# EasyEDA Pro project ProProject_luckycharm_2024-02-05.epro

# Schematic sch
Create Date: 2024-01-07; Page Name: P1; Project Name: 大富翁 幸运符; Schematic Name: sch; Update Date: 2024-02-02; Company: 嘉立创EDA; Drawed: m0dular; Page Size: A4; Version: V1.0
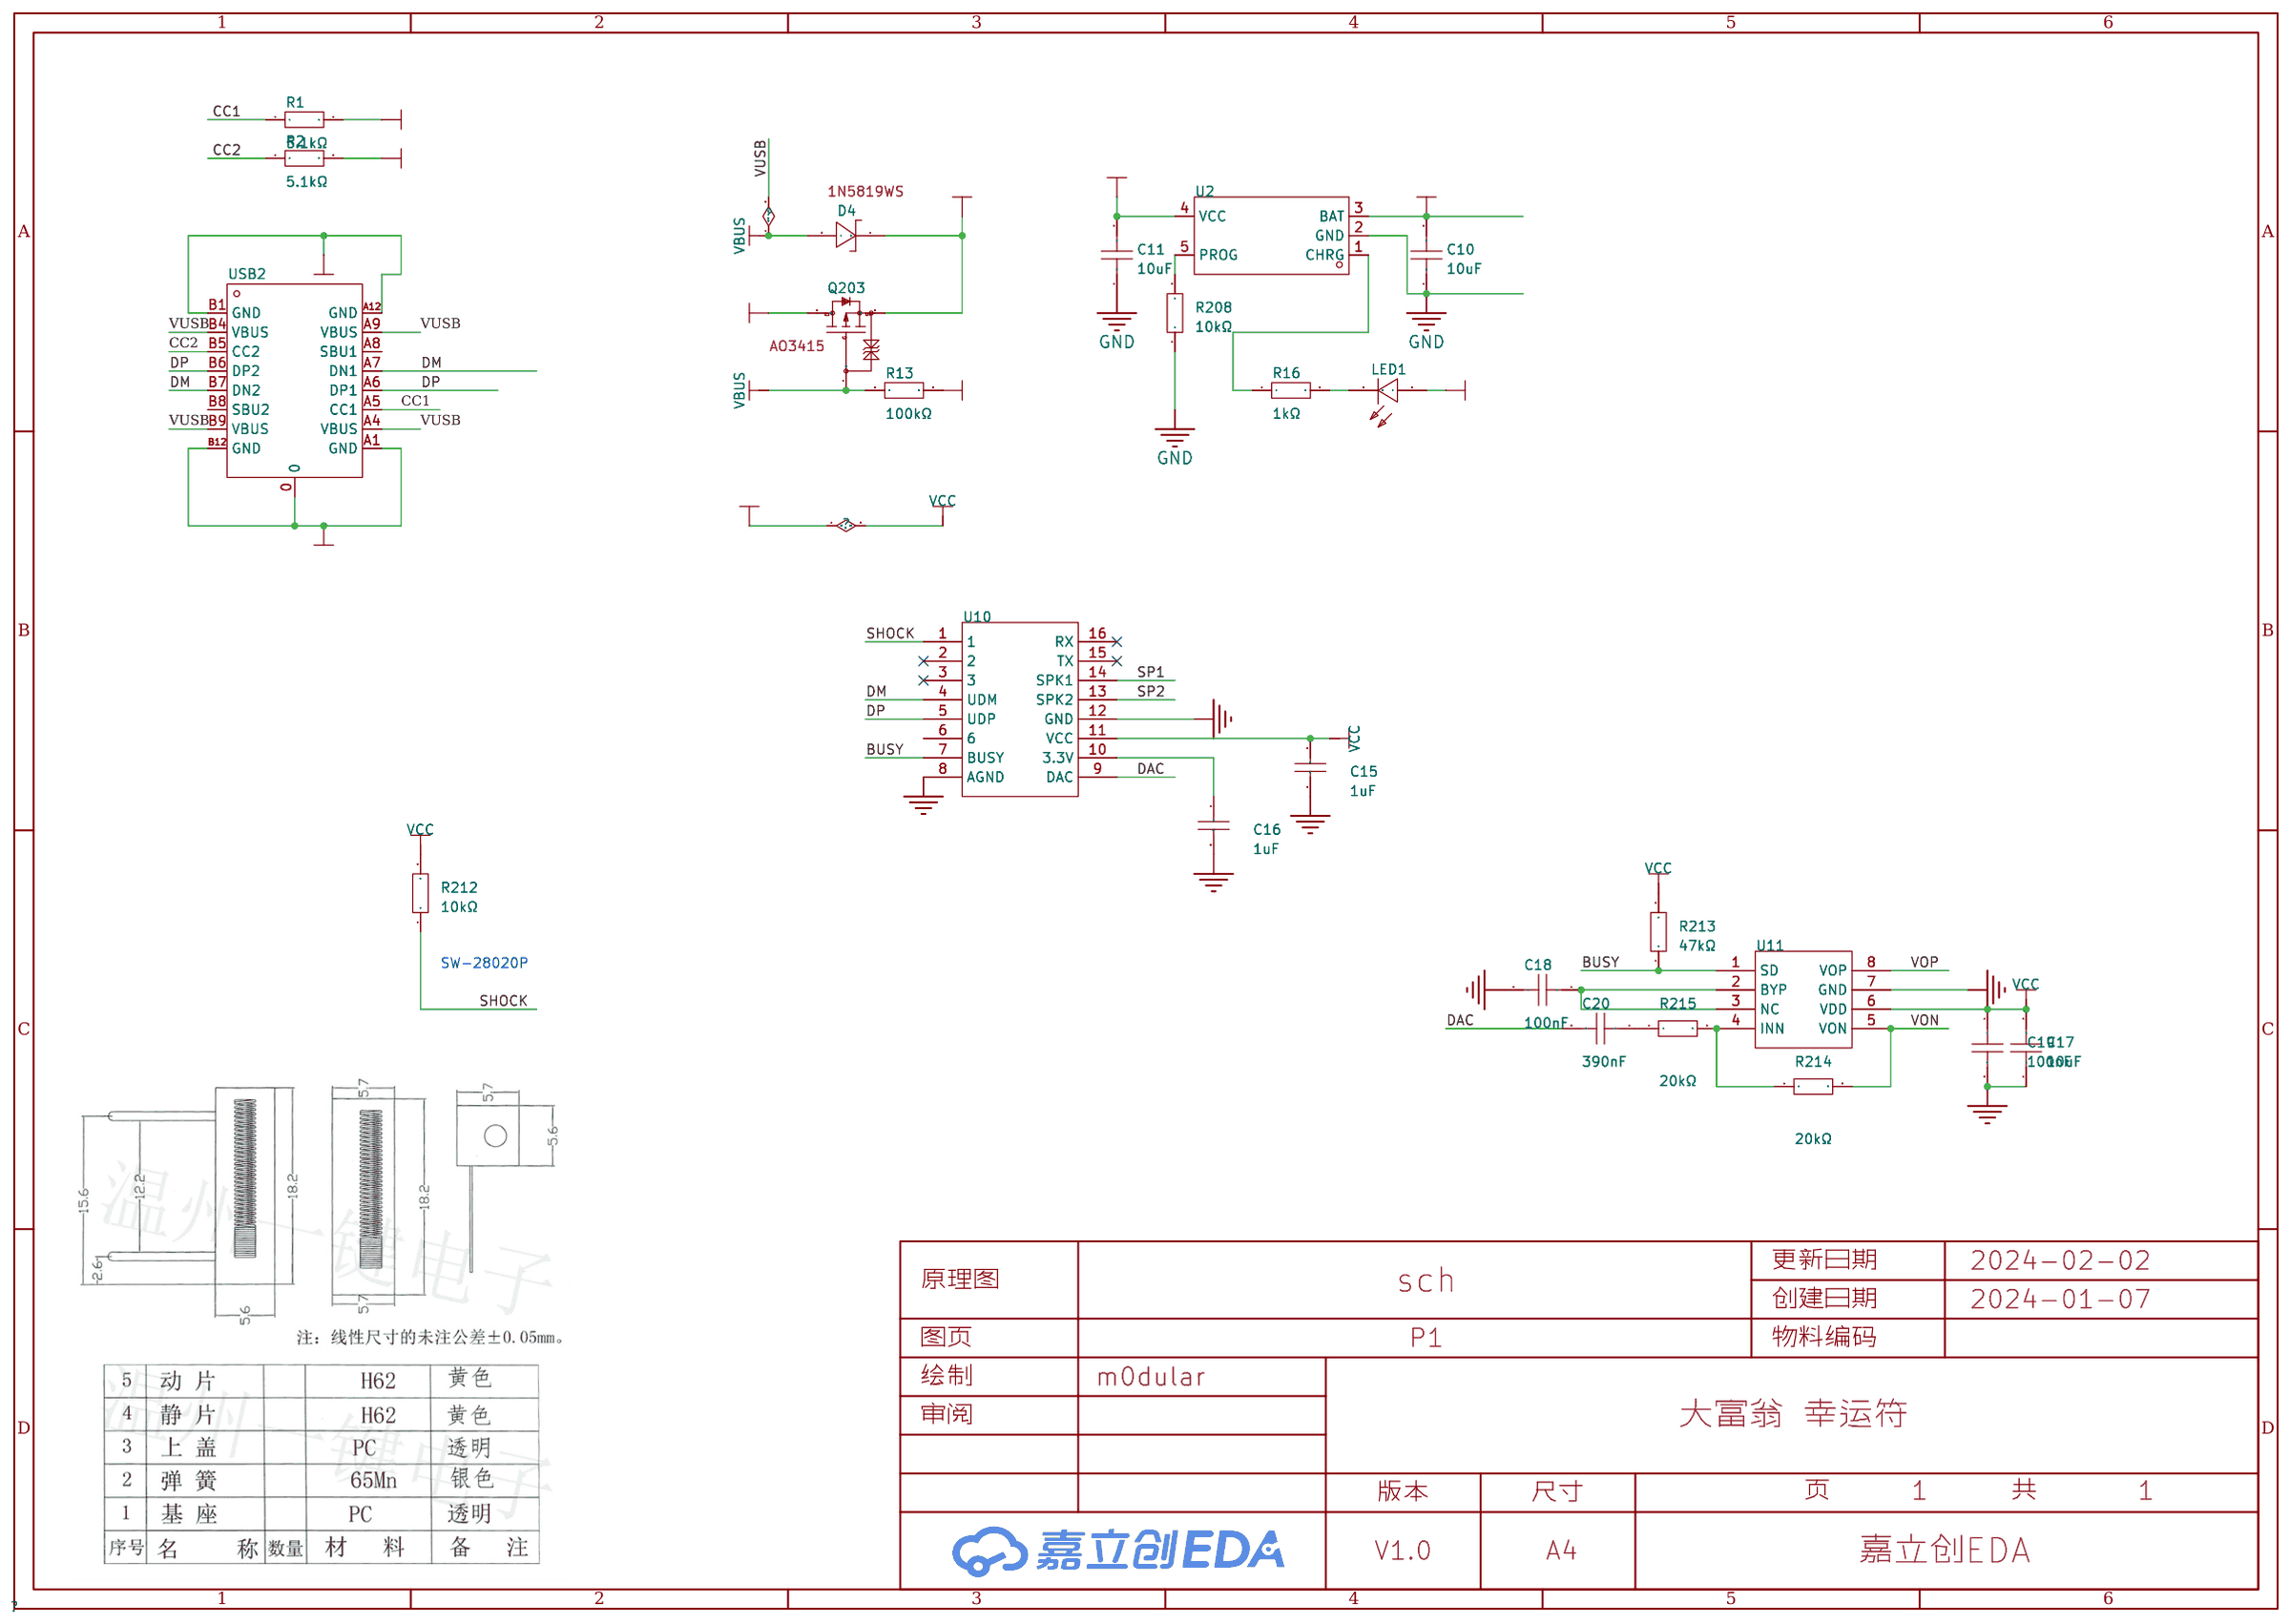
[diagram p0: schematic sheet]

## Parts
C10  10uF  [c0603]
C11  10uF  [c0603]
C15  1uF  [C0603]
C16  1uF  [C0603]
C17  10uF  [c0603]  (no BOM)
C18  100nF  [C0603]  (no BOM)
C19  100nF  [C0603]  (no BOM)
C20  390nF  [C0603]  (no BOM)
D4  -  [sod-323_l1.8-w1.3-ls2.5-rd]
LED1  -  [led0603-r-rd]
Q203  -  [sot-23-3_l2.9-w1.3-p1.90-ls2.4-br]
R1  5.1kΩ  [R0603]
R2  5.1kΩ  [R0603]
R13  100kΩ  [R0603]
R16  1kΩ  [R0603]
R208  10kΩ  [R0603]
R212  10kΩ  [R0603]
R213  47kΩ  [R0603]  (no BOM)
R214  20kΩ  [R0603]  (no BOM)
R215  20kΩ  [R0603]  (no BOM)
U2  -  [sot-23-5_l3.0-w1.7-p0.95-ls2.8-br]
U10  -  [SOP-16_L9.9-W3.9-P1.27-LS6.0-BL]
U11  -  [SOP-8_L4.9-W3.9-P1.27-LS6.2-TL]  (no BOM)
USB2  -  [usb-c_smd-type-c-31-m-12]

## Library data of the parts
C10 C11 C17 = CL10A106KP8NNNC: 容值:10uF;精度:±10%;额定电压:10V;温度系数:X5R;; LCSC Part Name: 10uF ±10% 10V; Supplier Part: C19702; Manufacturer: SAMSUNG(三星); Supplier Footprint: 0603; JLCPCB Part Class: Basic Part; Datasheet: https://atta.szlcsc.com/upload/public/pdf/source/20160103/1457707703378.pdf; Supplier: LCSC; Tolerance: ±10%; Voltage Rated: 10V; Temperature Coefficient: X5R
C15 C16 = CL10A105KB8NNNC: 容值:1uF;精度:±10%;额定电压:50V;材质(温度系数):X5R;; LCSC Part Name: 1uF ±10% 50V; Supplier Part: C15849; Manufacturer: SAMSUNG(三星); Supplier Footprint: 0603; JLCPCB Part Class: 基础库; Datasheet: https://atta.szlcsc.com/upload/public/pdf/source/20160218/1457707763339.pdf; Supplier: LCSC; Tolerance: ±10%; Voltage Rated: 50V; Temperature Coefficient: X5R
C18 C19 = CC0603KRX7R9BB104: 容值:100nF;精度:±10%;额定电压:50V;材质(温度系数):X7R;; LCSC Part Name: 100nF ±10% 50V; Supplier Part: C14663; Manufacturer: YAGEO(国巨); Supplier Footprint: 0603; JLCPCB Part Class: 基础库; Datasheet: https://atta.szlcsc.com/upload/public/pdf/source/20180910/C282072_33301C7F631E79921B82A8DAC6BCC5B3.pdf; Supplier: LCSC; Tolerance: ±10%; Voltage Rated: 50V; Temperature Coefficient: X7R
C20 = GCM188R71C394KA55D: 容值:390nF;精度:±10%;额定电压:16V;材质(温度系数):X7R;; LCSC Part Name: 390nF ±10% 16V; Supplier Part: C437460; Manufacturer: muRata(村田); Supplier Footprint: 0603; JLCPCB Part Class: 扩展库; Datasheet: https://atta.szlcsc.com/upload/public/pdf/source/20191226/C475964_3FAF76C90CD8FFB09F50C7480ADA926F.pdf; Supplier: LCSC; Tolerance: ±10%; Voltage Rated: 16V; Temperature Coefficient: X7R
D4 = 1N5819WS: 直流反向耐压(Vr):40V;平均整流电流(Io):1A;正向压降(Vf):600mV@1A;; LCSC Part Name: 40V 1A 600mV@1A; Supplier Part: C191023; Manufacturer: Hottech(合科泰); Supplier Footprint: SOD-323; JLCPCB Part Class: Basic Part; Datasheet: https://atta.szlcsc.com/upload/public/pdf/source/20180614/C191023_3C6A6398B911F3A4C23E7538EE054643.pdf; Supplier: LCSC; Reverse Voltage (Vr): 40V; Average Rectified Current (Io): 1A; Forward Voltage (Vf@If): 600mV@1A
LED1 = 19-217/R6C-AL1M2VY/3T: 发光颜色:红灯;二极管配置:-;透镜颜色:无色透明;主波长:617.5nm;峰值波长:632nm;色温:-;光通量(25时):-;测试电流:5mA;正向电压(VF):2.2V;发光强度:28.5mcd;功率:60mW;发光角度:120°;安装方式:-;工作温度:-40~+85;; LCSC Part Name: 红灯; Supplier Part: C72044; Manufacturer: EVERLIGHT(台湾亿光); Supplier Footprint: 0603; JLCPCB Part Class: Extended Part; Datasheet: https://atta.szlcsc.com/upload/public/pdf/source/20160507/1462613613821.pdf; Supplier: LCSC; Emitted Color: 红灯; Lens Color: 无色透明; Dominant Wavelength: 617.5nm; Peak Wavelength: 632nm; Forward Current: 5mA; Forward Voltage (VF): 2.2V; Luminous Intensity: 28.5mcd; Power Dissipation: 60mW; Viewing Angle: 120°; Operating Temperature: -40~+85
Q203 = AO3415_C181094: 类型:P沟道;漏源电压(Vdss):20V;连续漏极电流(Id):4A;功率(Pd):1.5W;导通电阻(RDS(on)@Vgs,Id):41mΩ@4.5V,4A;阈值电压(Vgs(th)@Id):900mV@250A;; LCSC Part Name: P沟道 20V 4A; Supplier Part: C181094; Manufacturer: Hottech(合科泰); Manufacturer Part: AO3415; Supplier Footprint: SOT-23(SOT-23-3); JLCPCB Part Class: Extended Part; Datasheet: https://atta.szlcsc.com/upload/public/pdf/source/20180131/C181094_15173931965481329223.pdf; Supplier: LCSC; Type: P沟道; Drain Source Voltage (Vdss): 20V; Continuous Drain Current (Id): 4A; Power Dissipation (Pd): 1.5W; Drain Source On Resistance (RDS(on)@Vgs,Id): 41mΩ@4.5V,4A; Gate Threshold Voltage (Vgs(th)@Id): 900mV@250A
R1 R2 = 0603WAF5101T5E: 电阻类型:厚膜电阻;阻值:5.1kΩ;精度:±1%;功率:1/10W;温度系数:±100ppm/;最大工作电压:75V;工作温度范围:-55~+155;; LCSC Part Name: 5.1kΩ ±1%; Supplier Part: C23186; Manufacturer: UNI-ROYAL(厚声); Supplier Footprint: 0603; JLCPCB Part Class: Basic Part; Datasheet: https://atta.szlcsc.com/upload/public/pdf/source/20200306/C422600_1E6D84923E4A46A82E41ADD87F860B5C.pdf; Supplier: LCSC; Type: 厚膜电阻; Tolerance: ±1%; Power(Watts): 1/10W; Temperature Coefficient: ±100ppm/; Overload Voltage (Max): 75V; Operating Temperature Range: -55~+155
R13 = 0603WAF1003T5E: 精度:±1%;阻值:100kΩ;温度系数:±100ppm/;功率:1/10W;最大工作电压:75V;工作温度范围:-55~+155;; LCSC Part Name: 100KΩ ±1%; Supplier Part: C25803; Manufacturer: UNI-ROYAL(厚声); Supplier Footprint: 0603; JLCPCB Part Class: Basic Part; Datasheet: https://atta.szlcsc.com/upload/public/pdf/source/20170920/C25803_1505901551039983376.pdf; Supplier: LCSC; Tolerance: ±1%; Temperature Coefficient: ±100ppm/; Power(Watts): 1/10W; Overload Voltage (Max): 75V; Operating Temperature Range: -55~+155
R16 = 0603WAF1001T5E: 电阻类型:厚膜电阻;阻值:1kΩ;精度:±1%;功率:1/10W;温度系数:±100ppm/;最大工作电压:75V;工作温度范围:-55~+155;; LCSC Part Name: 1kΩ ±1% 1/10W; Supplier Part: C21190; Manufacturer: UNI-ROYAL(厚声); Supplier Footprint: 0603; JLCPCB Part Class: Basic Part; Datasheet: https://atta.szlcsc.com/upload/public/pdf/source/20200306/C422600_1E6D84923E4A46A82E41ADD87F860B5C.pdf; Supplier: LCSC; Type: 厚膜电阻; Tolerance: ±1%; Power(Watts): 1/10W; Temperature Coefficient: ±100ppm/; Overload Voltage (Max): 75V; Operating Temperature Range: -55~+155
R208 R212 = 0603WAF1002T5E: 阻值:10kΩ;精度:±1%;功率:100mW;温度系数:±100ppm/℃;电阻类型:厚膜电阻;; LCSC Part Name: 10kΩ ±1% 100mW 厚膜电阻; Supplier Part: C25804; Manufacturer: UNI-ROYAL(厚声); Supplier Footprint: 0603; JLCPCB Part Class: Basic Part; Datasheet: https://atta.szlcsc.com/upload/public/pdf/source/20200306/C422600_1E6D84923E4A46A82E41ADD87F860B5C.pdf; Supplier: LCSC; Tolerance: ±1%; Power(Watts): 100mW; Overload Voltage (Max): 75V; Temperature Coefficient: ±100ppm/℃; Type: 厚膜电阻; Operating Temperature Range: -55℃~+155℃
R213 = 0603WAF4702T5E: 阻值:47kΩ;精度:±1%;功率:100mW;温度系数:±100ppm/℃;电阻类型:厚膜电阻;; LCSC Part Name: 47kΩ ±1% 100mW 厚膜电阻; Supplier Part: C25819; Manufacturer: UNI-ROYAL(厚声); Supplier Footprint: 0603; JLCPCB Part Class: 基础库; Datasheet: https://atta.szlcsc.com/upload/public/pdf/source/20200306/C422600_1E6D84923E4A46A82E41ADD87F860B5C.pdf; Supplier: LCSC; Tolerance: ±1%; Power(Watts): 100mW; Overload Voltage (Max): 75V; Temperature Coefficient: ±100ppm/℃; Type: 厚膜电阻; Operating Temperature Range: -55℃~+155℃
R214 R215 = 0603WAF2002T5E: 阻值:20kΩ;精度:±1%;功率:100mW;温度系数:±100ppm/℃;电阻类型:厚膜电阻;; LCSC Part Name: 20kΩ ±1% 100mW 厚膜电阻; Supplier Part: C4184; Manufacturer: UNI-ROYAL(厚声); Supplier Footprint: 0603; JLCPCB Part Class: Basic Part; Datasheet: https://atta.szlcsc.com/upload/public/pdf/source/20200306/C422600_1E6D84923E4A46A82E41ADD87F860B5C.pdf; Supplier: LCSC; Tolerance: ±1%; Power(Watts): 100mW; Overload Voltage (Max): 75V; Temperature Coefficient: ±100ppm/℃; Type: 厚膜电阻; Operating Temperature Range: -55℃~+155℃
U2 = TP4054-42-SOT25R: 充电电池的类型:-;电池单元组数:-;最大充电电流:-;充满的电池组电压:-;最大供应电压:-;; Supplier Part: C32574; Manufacturer: TOPPOWER(南京拓微); Supplier Footprint: SOT-23-5; JLCPCB Part Class: Basic Part; Datasheet: https://atta.szlcsc.com/upload/public/pdf/source/20140621/1457707095588.pdf; Supplier: LCSC
U10 = CH7800: 语音IC
U11 = CH03D: 3w功放
USB2 = USB-TYPE-C-018: 连接器类型:Type-C;标准:-;公母:母座;触点数量:16;端口数量:1;安装方式:卧贴;额定电流 - 电源:3A;工作温度范围:-25~+85;; Supplier Part: C2927038; Manufacturer: DEALON(德艺隆); Supplier Footprint: SMD; JLCPCB Part Class: Extended Part; Datasheet: https://atta.szlcsc.com/upload/public/pdf/source/20211217/CCD3D517E355E8E0CC52ABD8D5784AD8.pdf; Supplier: LCSC; Connector Type: Type-C; Gender: 母座; Number of Contacts: 16; Number of Ports: 1; Mounting Style: 卧贴; Current Rating - Power (Max): 3A; Operating Temperature Range: -25~+85

## Nets
GND: C10.1 C11.1 C15.2 C16.2 C17.1 C18.2 C19.2 R1.2 R2.2 R13.2 R208.1 U2.2(GND) U10.8(AGND) U10.12(GND) U11.7(GND) USB2.0 USB2.A1(GND) USB2.A12(GND) USB2.B1(GND) USB2.B12(GND)
VBAT: C10.2 Q203.3(D) U2.3(BAT)
VBUS: C11.2 D4.2(A) LED1.1(A) Q203.1(G) R13.1 U2.4(VCC) USB2.A4(VBUS) USB2.A9(VBUS) USB2.B4(VBUS) USB2.B9(VBUS)
VCC: C15.1 C17.2 C19.1 D4.1(C) Q203.2(S) R212.2 R213.2 U10.11(VCC) U11.6(VDD)
BUSY: R213.1 U10.7(BUSY) U11.1(SD)
CC1: R1.1 USB2.A5(CC1)
CC2: R2.1 USB2.B5(CC2)
DAC: C20.2 U10.9(DAC)
DM: U10.4(UDM) USB2.A7(DN1) USB2.B7(DN2)
DP: U10.5(UDP) USB2.A6(DP1) USB2.B6(DP2)
SHOCK: R212.1 U10.1
SP1: U10.14(SPK1)
SP2: U10.13(SPK2)
VON: R214.2 U11.5(VON)
VOP: U11.8(VOP)
$1N932: R208.2 U2.5(PROG)
$1N934: R16.1 U2.1(CHRG)
$1N935: LED1.2(C) R16.2
$1N7645: C16.1 U10.10(3.3V)
$1N8072: C18.1 U11.2(BYP) U11.3(NC)
$1N8220: R214.1 R215.2 U11.4(INN)
$1N8293: C20.1 R215.1

Not connected (* = marked no-connect by the designer): U10 2* 3* 6 15(TX)* 16(RX)*; USB2 A8(SBU1) B8(SBU2)

## Notes on the sheet
- SW-28020P

# Board PCB1_3
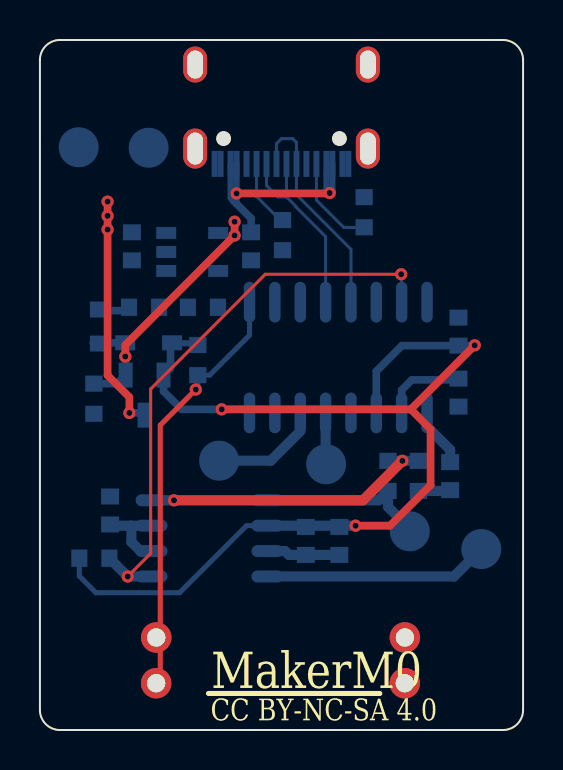
[diagram p1: board, top side]
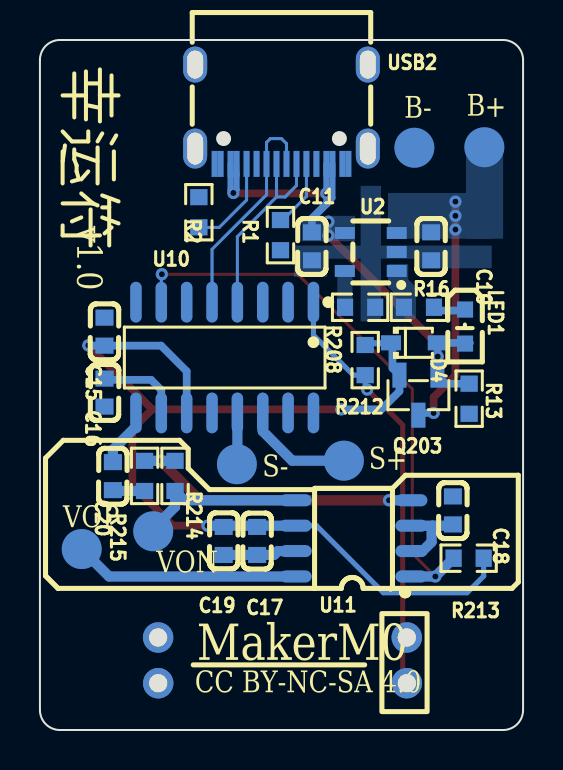
[diagram p2: board, bottom side, seen from below]

Outline 24.2 x 34.5 mm; copper layers: Top Layer, Bottom Layer. Coordinates in mm from the lower left corner of the outline.
Outline path: 0,33.5 0,1 arc(0.29,0.29) 1,0 23.2,0 arc(23.91,0.29) 24.2,1 24.2,33.5 arc(23.91,34.21) 23.2,34.5 1,34.5 arc(0.29,34.21) 0,33.5
Stack: Top Layer 0.035mm / Dielectric1 1.51mm FR4 er 4.5 / Bottom Layer 0.035mm

## Design rules (mm)
template: JLCPCB Capability(Two Layers Board)
spacing copperThickness1oz (default): track to track 0.102, other pairs 0.152 to 0.3
spacing copperThickness2oz: track to track 0.203, other pairs 0.152 to 0.3
track width copperThickness1oz (default): min 0.127, default 0.254, max 2.54
track width copperThickness2oz: min 0.203, default 0.254, max 2.54
differential pair differentialPair (default): width min 0.127, default 0.254, max 2.54; gap min 0.152, default 0.152
via viaSize (default): diameter min 0.5, default 0.61, max 10; hole min 0.3, default 0.305, max 6.3

## Placement (name value [footprint] x y rotation side)
C10  10uF  [c0603]  4.61 24.18 90 bottom
C11  10uF  [c0603]  10.58 24.18 90 bottom
C15  1uF  [C0603]  20.96 19.92 90 bottom
C16  1uF  [C0603]  20.96 16.87 270 bottom
C17  10uF  [c0603]  13.32 9.45 90 bottom
C18  100nF  [C0603]  3.51 10.98 90 bottom
C19  100nF  [C0603]  15 9.45 270 bottom
C20  390nF  [C0603]  20.55 12.69 90 bottom
D4  -  [sod-323_l1.8-w1.3-ls2.5-rd]  5.44 19.36 180 bottom
LED1  -  [led0603-r-rd]  2.91 20.17 270 bottom
NOREF  -  [Pad_e274]  5.44 29.11 0 top
NOREF#2  -  [Pad_e15]  5.82 2.34 0 top
NOREF#3  -  [Pad_e273]  1.94 29.14 0 top
NOREF#4  -  [Pad_e260]  14.34 13.29 90 top
NOREF#5  -  [Pad_e18]  18.28 4.63 0 top
NOREF#6  -  [Pad_e546]  22.11 9.05 180 top
NOREF#7  -  [Pad_e545]  18.53 9.94 180 top
NOREF#8  -  [Pad_e259]  8.98 13.47 90 top
NOREF#9  -  [Pad_e17]  18.28 2.34 0 top
NOREF#10  -  [Pad_e19]  5.83 4.63 0 top
Q203  -  [sot-23-3_l2.9-w1.3-p1.90-ls2.4-br]  5.24 16.74 90 bottom
R1  5.1kΩ  [R0603]  12.15 24.74 270 bottom
R2  5.1kΩ  [R0603]  16.24 25.89 90 bottom
R13  100kΩ  [R0603]  2.7 16.56 270 bottom
R16  1kΩ  [R0603]  5.22 21.14 180 bottom
R208  10kΩ  [R0603]  8.16 21.14 0 bottom
R212  10kΩ  [R0603]  7.91 18.5 90 bottom
R213  47kΩ  [R0603]  2.73 8.59 180 bottom
R214  20kΩ  [R0603]  17.43 12.7 270 bottom
R215  20kΩ  [R0603]  18.96 12.7 90 bottom
U2  -  [sot-23-5_l3.0-w1.7-p0.95-ls2.8-br]  7.63 23.9 180 bottom
U10  -  [SOP-16_L9.9-W3.9-P1.27-LS6.0-BL]  14.94 18.62 0 bottom
U11  -  [SOP-8_L4.9-W3.9-P1.27-LS6.2-TL]  8.49 9.58 0 bottom
USB2  -  [usb-c_smd-type-c-31-m-12]  12.1 30.79 0 bottom

## Footprints (pads in the part's own frame, mm; a bottom-side part is the same pattern mirrored in y, then rotated)
c0603
  rect 0.8x0.9 smd: 1(-0.7,0) 2(0.7,0)
C0603
  rect 0.8x0.9 smd: 1(-0.7,0) 2(0.7,0)
led0603-r-rd
  rect 0.8x0.8 smd: 1(0.851,0) 2(-0.851,0)
Pad_e15
  round 1.524 hole 0.914: 3(0,0)
Pad_e17
  round 1.524 hole 0.914: 3(0,0)
Pad_e18
  round 1.524 hole 0.914: 3(0,0)
Pad_e19
  round 1.524 hole 0.914: 3(0,0)
Pad_e259
  round 2 smd far side: 4(0,0)
Pad_e260
  round 2 smd far side: 5(0,0)
Pad_e273
  round 2 smd far side: 6(0,0)
Pad_e274
  round 2 smd far side: 7(0,0)
Pad_e545
  round 2 smd far side: 5(0,0)
Pad_e546
  round 2 smd far side: 4(0,0)
R0603
  rect 0.806x0.864 smd: 1(-0.753,0) 2(0.753,0)
sod-323_l1.8-w1.3-ls2.5-rd
  rect 1.001x0.75 smd: 1(-1.173,0) 2(1.173,0)
SOP-8_L4.9-W3.9-P1.27-LS6.2-TL
  oval 1.6x0.6 smd: 1(-2.9,1.905) 2(-2.9,0.635) 3(-2.9,-0.635) 4(-2.9,-1.905) 5(2.9,-1.905) 6(2.9,-0.635) 7(2.9,0.635) 8(2.9,1.905)
SOP-16_L9.9-W3.9-P1.27-LS6.0-BL
  oval 0.574x2.038 smd: 1(-4.445,-2.769) 2(-3.175,-2.769) 3(-1.905,-2.769) 4(-0.635,-2.769) 5(0.635,-2.769) 6(1.905,-2.769) 7(3.175,-2.769) 8(4.445,-2.769) 9(4.445,2.769) 10(3.175,2.769) 11(1.905,2.769) 12(0.635,2.769) 13(-0.635,2.769) 14(-1.905,2.769) 15(-3.175,2.769) 16(-4.445,2.769)
sot-23-3_l2.9-w1.3-p1.90-ls2.4-br
  rect 1.25x0.701 smd: 1(1.001,-0.95) 2(1.001,0.95) 3(-1.001,0)
sot-23-5_l3.0-w1.7-p0.95-ls2.8-br
  rect 1.001x0.6 smd: 1(1.3,-0.95) 2(1.3,0) 3(1.3,0.95) 4(-1.3,0.95) 5(-1.3,-0.95)
usb-c_smd-type-c-31-m-12
  oval 1.2x1.8 hole 0.8x1.4: 0(-4.325,-2.484) 0(4.325,-2.484)
  oval 1.2x2 hole 0.8x1.6: 0(-4.325,1.716) 0(4.325,1.716)
  rect 0.3x1.3 smd: A1(-3.35,2.484) A4(-2.55,2.484) A5(-1.25,2.484) A6(-0.25,2.484) A7(0.25,2.484) A8(1.25,2.484) A9(2.55,2.484) A12(3.35,2.484) B1(3.05,2.484) B4(2.25,2.484) B5(1.75,2.484) B6(0.75,2.484) B7(-0.75,2.484) B8(-1.75,2.484) B9(-2.25,2.484) B12(-3.05,2.484)

## Nets
GND: C10.1 C11.1 C15.2 C16.2 C17.1 C18.2 C19.2 NOREF.7 NOREF#5.3 NOREF#9.3 R1.2 R2.2 R13.2 R208.1 U2.2 U10.8 U10.12 U11.7 USB2.0 USB2.A1 USB2.A12 USB2.B1 USB2.B12
VBAT: C10.2 NOREF#3.6 Q203.3 U2.3
VBUS: C11.2 D4.2 LED1.1 Q203.1 R13.1 U2.4 USB2.A4 USB2.A9 USB2.B4 USB2.B9
VCC: C15.1 C17.2 C19.1 D4.1 Q203.2 R212.2 R213.2 U10.11 U11.6
BUSY: R213.1 U10.7 U11.1
CC1: R1.1 USB2.A5
CC2: R2.1 USB2.B5
DAC: C20.2 U10.9
DM: U10.4 USB2.A7 USB2.B7
DP: U10.5 USB2.A6 USB2.B6
SHOCK: NOREF#2.3 NOREF#10.3 R212.1 U10.1
SP1: NOREF#8.4 U10.14
SP2: NOREF#4.5 U10.13
VON: NOREF#7.5 R214.2 U11.5
VOP: NOREF#6.4 U11.8
$1N932: R208.2 U2.5
$1N934: R16.1 U2.1
$1N935: LED1.2 R16.2
$1N7645: C16.1 U10.10
$1N8072: C18.1 U11.2 U11.3
$1N8220: R214.1 R215.2 U11.4
$1N8293: C20.1 R215.1

Pads without a net: U10 2 3 6 15 16; USB2 A8 B8

## Via types
v1: diameter 0.61, hole 0.305, Top Layer to Bottom Layer, 17 vias

## Routing (per net, layer and track width the routed paths; a pad name or vN(x,y) marks a point on that pad's centre or on a via; arc(x,y) is an arc through that point)
GND: length 3.7
  Bottom Layer w0.508: C19.2 C17.1 12.47,8.75 12.28,8.95 U11.7
VBAT: length 11.8
  Top Layer w0.381: v1(4.48,15.85) 4.48,16.64 3.39,17.73 v1(3.39,25.02) v1(3.39,25.71) v1(3.39,26.42)
  Bottom Layer w0.381: v1(4.48,15.85) 5.15,15.85 5.24,15.94
VBUS: length 27.3
  Top Layer w0.381: v1(14.51,26.85) 14.49,26.83 v1(9.85,26.83) ; v1(9.75,25.41) v1(9.75,24.73) 4.28,19.25 v1(4.28,18.67)
  Bottom Layer w0.254: 14.35,27.84 USB2.B4
  Bottom Layer w0.305: 9.69,26.47 9.55,26.61 USB2.A4 ; USB2.B9 v1(9.85,26.83) 9.85,26.31 ; 14.35,27.84 14.35,27.01 v1(14.51,26.85) 14.65,26.99 USB2.A9
  Bottom Layer w0.381: 4.29,17.95 4.29,19.26 4.2,19.36 2.66,19.36 ; 9.69,26.47 10.58,25.58 C11.2 ; 4.29,17.74 3.87,17.32 R13.1
VCC: length 54.1
  Top Layer w0.381: v1(21.78,19.23) 18.58,16.03 ; 18.58,16.03 v1(9.1,16.03) ; 18.58,16.03 19.57,15.04 19.57,12.25 17.54,10.22 v1(15.81,10.22)
  Bottom Layer w0.254: U11.6 10.35,10.22 6.99,6.86 2.8,6.86 1.97,7.69 R213.2
  Bottom Layer w0.305: 6.54,19.34 7.82,19.34 R212.2
  Bottom Layer w0.381: U10.11 16.85,17.94 18.13,19.22 C15.1 21.76,19.22 v1(21.78,19.23) ; 6.54,19.36 6.54,18.09 6.19,17.74 6.19,16.94 7.1,16.03 v1(9.1,16.03)
  Bottom Layer w0.508: U11.6 v1(15.81,10.22)
BUSY: length 28.7
  Top Layer w0.152: v1(4.39,7.68) 5.55,8.83 5.55,17.05 11.29,22.79 v1(18.09,22.79)
  Bottom Layer w0.152: v1(18.09,22.79) 18.12,22.76 U10.7
  Bottom Layer w0.508: R213.1 v1(4.39,7.68) U11.1
CC1: length 3.4
  Bottom Layer w0.152: USB2.A5 10.85,26.68 12.03,25.5 R1.1
CC2: length 5.2
  Bottom Layer w0.152: USB2.B5 13.85,26.5 15.22,25.13 16.32,25.13 16.55,25.35
DAC: length 2.9
  Bottom Layer w0.508: C20.2 20.55,14.01 19.39,15.17 U10.9
DM: length 10
  Bottom Layer w0.152: U10.4 14.31,24.67 12.81,26.17 12.81,26.19 12.35,26.65 ; USB2.B7 11.35,27.22 11.92,26.65 12.35,26.65 ; 12.35,26.65 USB2.A7
DP: length 11.3
  Bottom Layer w0.152: U10.5 15.58,24.03 12.85,26.76 USB2.B6 12.85,29.38 12.66,29.57 12.1,29.57 11.85,29.32 USB2.A6
SHOCK: length 21.3
  Top Layer w0.254: v1(7.81,17.02) 6.03,15.25 6.03,2.55 NOREF#2.3
  Bottom Layer w0.254: U10.1 10.5,19.74 8.5,17.74 R212.1 7.91,17.12 v1(7.81,17.02)
SP1: length 5.6
  Bottom Layer w0.508: U10.14 13.04,14.94 11.57,13.47 NOREF#8.4
SP2: length 2.6
  Bottom Layer w0.508: U10.13 14.31,13.31 NOREF#4.5
VON: length 9
  Bottom Layer w0.508: U11.5 16.97,11.49 R214.2 17.43,11.16 18.83,9.76
VOP: length 11.3
  Bottom Layer w0.508: NOREF#6.4 20.74,7.68 U11.8
$1N935: length 1.6
  Bottom Layer w0.381: 4.36,21.14 4.2,20.97 2.86,20.97 2.83,21
$1N7645: length 4.2
  Bottom Layer w0.381: C16.1 20.9,17.51 18.63,17.51 18.12,17 U10.10
$1N8072: length 4.2
  Bottom Layer w0.508: U11.2 5.04,8.95 4.58,9.4 4.58,10.18 4.54,10.22 ; 4.54,10.22 U11.3 ; 4.54,10.22 3.55,10.22 3.49,10.28
$1N8220: length 14.9
  Top Layer w0.508: v1(18.16,13.46) 16.18,11.49 v1(6.72,11.49)
  Bottom Layer w0.508: R215.2 v1(18.16,13.46) R214.1 ; U11.4 v1(6.72,11.49)
$1N8293: length 1.6
  Bottom Layer w0.508: R215.1 20.5,11.95 C20.1

## Copper pours and planes (outline as drawn; the poured copper is in the pictures)
GND on Top Layer: -1.01,37.34 26.02,37.34 26.02,-5.74 -1.01,-5.74
GND on Bottom Layer: -4.18,35.77 26.5,35.77 26.5,-3.96 -4.18,-3.96
GND on Bottom Layer: 1.57,24.22 11.47,24.22 11.47,22.66 1.57,22.66
GND on Bottom Layer: 7.12,27.21 8.14,27.21 8.14,20.43 7.12,20.43
VBAT on Bottom Layer: 1,29.21 2.85,29.21 2.85,24.57 1,24.57
VBAT on Bottom Layer: 1.56,26.85 6.77,26.85 6.77,24.56 1.56,24.56
VBUS on Bottom Layer: 8.42,25.71 11.08,25.71 11.08,24.44 8.42,24.44
$1N932 on Bottom Layer: 8.54,23.21 9.31,23.21 9.31,20.76 8.54,20.76
$1N934 on Bottom Layer: 5.37,23.3 6.77,23.3 6.77,20.5 5.37,20.5

## Text on the board
Bottom Silkscreen Layer: v1.0 | B+ | B- | S+ | S- | CC BY-NC-SA 4.0 | VON | VOP | MakerM0 | 幸运符
Top Silkscreen Layer: CC BY-NC-SA 4.0 | MakerM0
